# Altium schematic sheet SMALL.SchDoc
size A
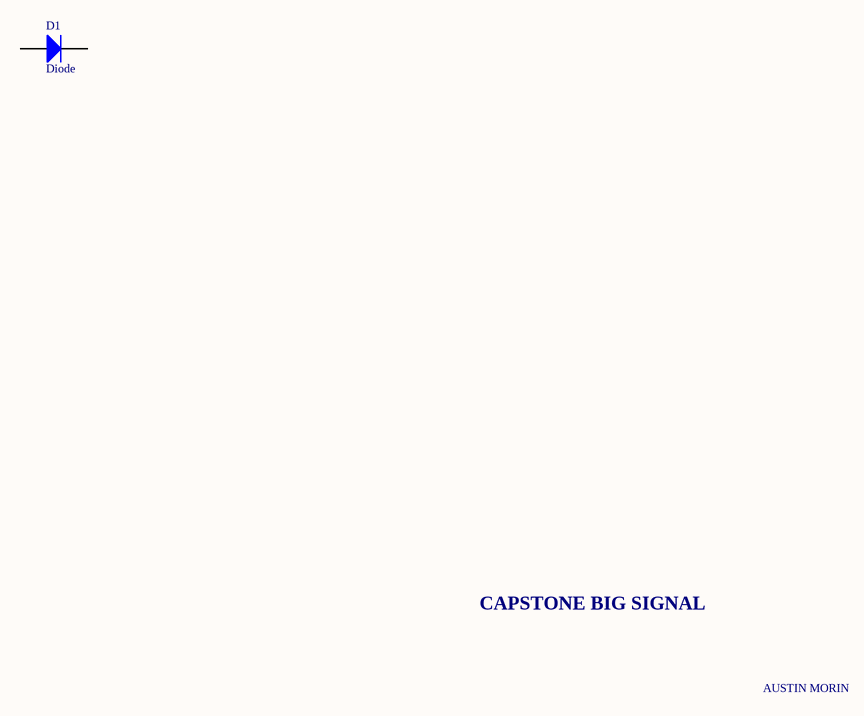
[diagram p0: SMALL.SchDoc]

## Parts
D1  Diode  [SMC]

## Nets

Not connected (* = marked no-connect by the designer): D1 1(A) 2(K)

## Notes on the sheet
- CAPSTONE BIG SIGNAL
- AUSTIN MORIN

## Library data of the parts
D1 = Diode: Default Diode; Published: 8-Jun-2000; LatestRevisionDate: 17-Jul-2002; LatestRevisionNote: Re-released for DXP Platform.; PackageVersion: Sep-1996; PackageReference: SMC; Publisher: Altium Limited; PackageDescription: DO-214-AB/SMC; 2 C-Bend Leads; Body 7.9 x 5.9 mm, inc. leads (LxW); Code_JEDEC: DO-214-AB